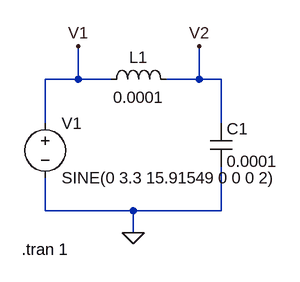
[diagram p0: schematic Draft1.asc]
Draft1.asc, the LTspice schematic file:
Version 4
SHEET 1 880 680
WIRE 80 48 80 0
WIRE 80 48 32 48
WIRE 128 48 80 48
WIRE 256 48 256 0
WIRE 256 48 208 48
WIRE 288 48 256 48
WIRE 32 112 32 48
WIRE 288 112 288 48
WIRE 32 240 32 192
WIRE 160 240 32 240
WIRE 288 240 288 176
WIRE 288 240 160 240
WIRE 160 272 160 240
FLAG 80 0 V1
FLAG 256 0 V2
FLAG 160 272 0
SYMBOL voltage 32 96 R0
WINDOW 123 0 0 Left 0
WINDOW 39 0 0 Left 0
SYMATTR InstName V1
SYMATTR Value SINE(0 3.3 15.91549 0 0 0 2)
SYMBOL ind 112 64 R270
WINDOW 0 32 56 VTop 2
WINDOW 3 5 56 VBottom 2
SYMATTR InstName L1
SYMATTR Value 0.0001
SYMBOL cap 272 112 R0
SYMATTR InstName C1
SYMATTR Value 0.0001
TEXT -2 296 Left 2 !.tran 1

The netlist it stands for:
* Draft1.asc
V1 V1 0 SINE(0 3.3 15.91549 0 0 0 2)
L1 V1 V2 0.0001
C1 V2 0 0.0001
.tran 1
.backanno
.end

* Results of the author's LTspice run, read from the files saved beside the schematic
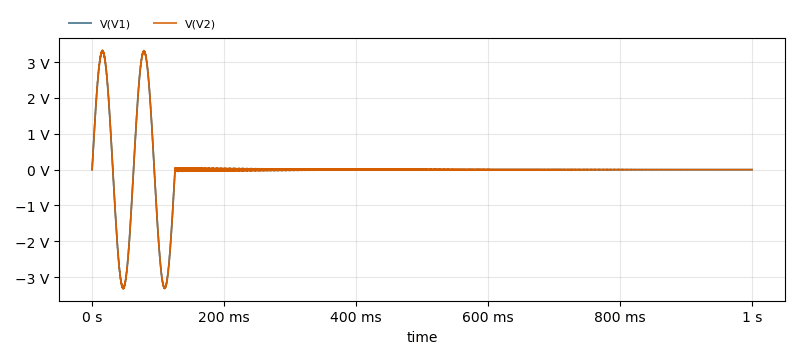
[diagram p1: Transient Analysis of Draft1.asc, plotted from the saved traces]
* Transient Analysis, 1 run:
*   V(V1): min -3.3 V, max 3.3 V, average 0 V, rms 827.2 mV, last 0 V
*   V(V2): min -3.325 V, max 3.33 V, average 409.8 nV, rms 827.4 mV, last 684.8 µV